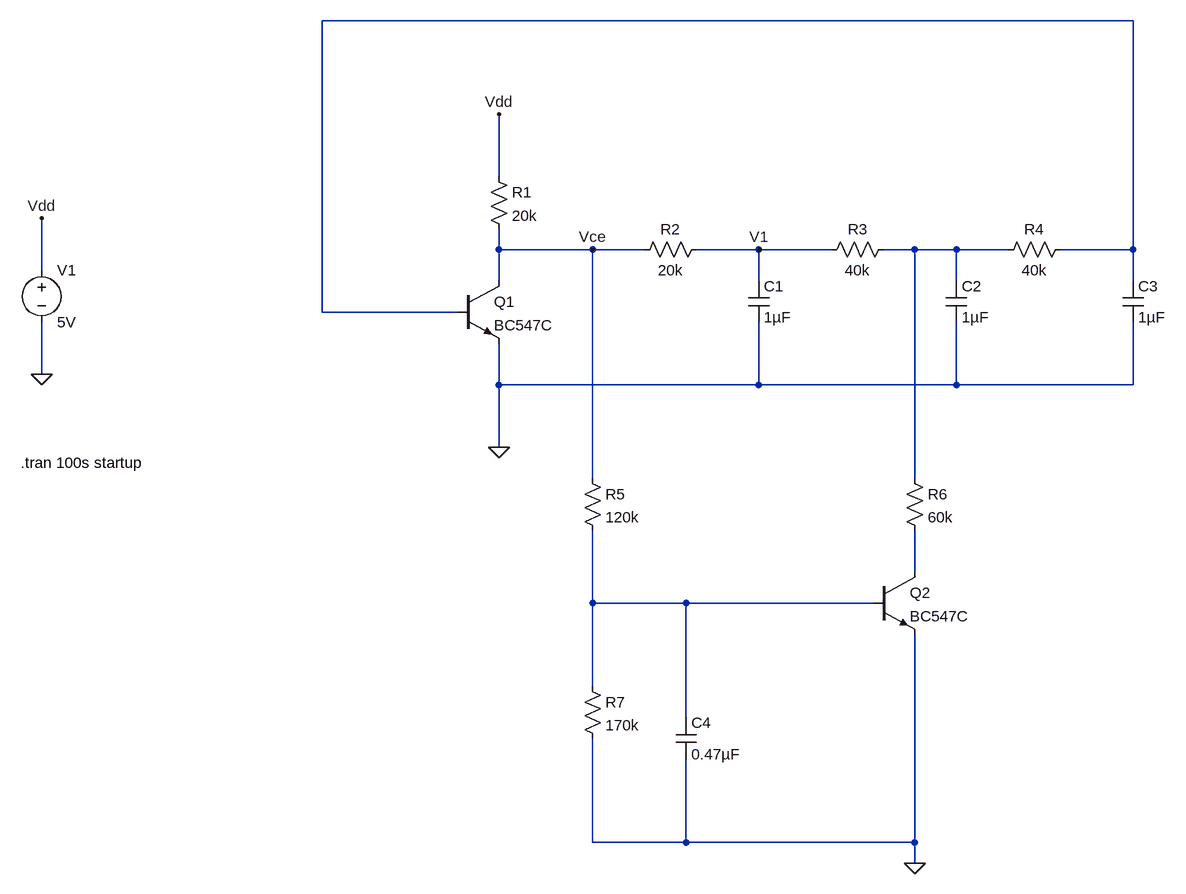
[diagram p0: schematic chaotic_osc_slow.asc]
chaotic_osc_slow.asc, the LTspice schematic file:
Version 4
SHEET 1 2148 1108
WIRE 1088 -208 -160 -208
WIRE 112 32 112 -64
WIRE 112 144 112 112
WIRE 256 144 112 144
WIRE 336 144 256 144
WIRE 512 144 416 144
WIRE 624 144 512 144
WIRE 752 144 704 144
WIRE 816 144 752 144
WIRE 896 144 816 144
WIRE 1088 144 1088 -208
WIRE 1088 144 976 144
WIRE -592 176 -592 96
WIRE 112 192 112 144
WIRE 512 192 512 144
WIRE 816 192 816 144
WIRE 1088 192 1088 144
WIRE -160 240 -160 -208
WIRE 48 240 -160 240
WIRE -592 336 -592 256
WIRE 112 352 112 288
WIRE 512 352 512 256
WIRE 512 352 112 352
WIRE 816 352 816 256
WIRE 816 352 512 352
WIRE 1088 352 1088 256
WIRE 1088 352 816 352
WIRE 112 448 112 352
WIRE 256 496 256 144
WIRE 752 496 752 144
WIRE 752 640 752 576
WIRE 256 688 256 576
WIRE 400 688 256 688
WIRE 688 688 400 688
WIRE 256 816 256 688
WIRE 400 864 400 688
WIRE 256 1056 256 896
WIRE 400 1056 400 928
WIRE 400 1056 256 1056
WIRE 752 1056 752 736
WIRE 752 1056 400 1056
WIRE 752 1088 752 1056
FLAG 112 448 0
FLAG 112 -64 Vdd
FLAG -592 336 0
FLAG -592 96 Vdd
FLAG 752 1088 0
FLAG 512 144 V1
FLAG 256 144 Vce
SYMBOL res 96 16 R0
SYMATTR InstName R1
SYMATTR Value 20k
SYMBOL res 432 128 R90
WINDOW 0 0 56 VBottom 2
WINDOW 3 32 56 VTop 2
SYMATTR InstName R2
SYMATTR Value 20k
SYMBOL res 720 128 R90
WINDOW 0 0 56 VBottom 2
WINDOW 3 32 56 VTop 2
SYMATTR InstName R3
SYMATTR Value 40k
SYMBOL res 992 128 R90
WINDOW 0 0 56 VBottom 2
WINDOW 3 32 56 VTop 2
SYMATTR InstName R4
SYMATTR Value 40k
SYMBOL cap 496 192 R0
SYMATTR InstName C1
SYMATTR Value 1µF
SYMBOL cap 800 192 R0
SYMATTR InstName C2
SYMATTR Value 1µF
SYMBOL cap 1072 192 R0
SYMATTR InstName C3
SYMATTR Value 1µF
SYMBOL npn 48 192 R0
SYMATTR InstName Q1
SYMATTR Value BC547C
SYMBOL voltage -592 160 R0
WINDOW 123 0 0 Left 0
WINDOW 39 0 0 Left 0
SYMATTR InstName V1
SYMATTR Value 5V
SYMBOL res 240 480 R0
SYMATTR InstName R5
SYMATTR Value 120k
SYMBOL res 736 480 R0
SYMATTR InstName R6
SYMATTR Value 60k
SYMBOL res 240 800 R0
SYMATTR InstName R7
SYMATTR Value 170k
SYMBOL cap 384 864 R0
SYMATTR InstName C4
SYMATTR Value 0.47µF
SYMBOL npn 688 640 R0
SYMATTR InstName Q2
SYMATTR Value BC547C
TEXT -624 472 Left 2 !.tran 100s startup

The netlist it stands for:
* chaotic_osc_slow.asc
R1 Vdd Vce 20k
R2 V1 Vce 20k
R3 N002 V1 40k
R4 N001 N002 40k
C1 V1 0 1µF
C2 N002 0 1µF
C3 N001 0 1µF
Q1 Vce N001 0 0 BC547C
V1 Vdd 0 5V
R5 Vce N004 120k
R6 N002 N003 60k
R7 N004 0 170k
C4 N004 0 0.47µF
Q2 N003 N004 0 0 BC547C
.model NPN NPN
.model PNP PNP
.lib standard.bjt
.tran 100s startup
.backanno
.end